# Altium project Signal Generator.PrjPcb (part 1 of 2)
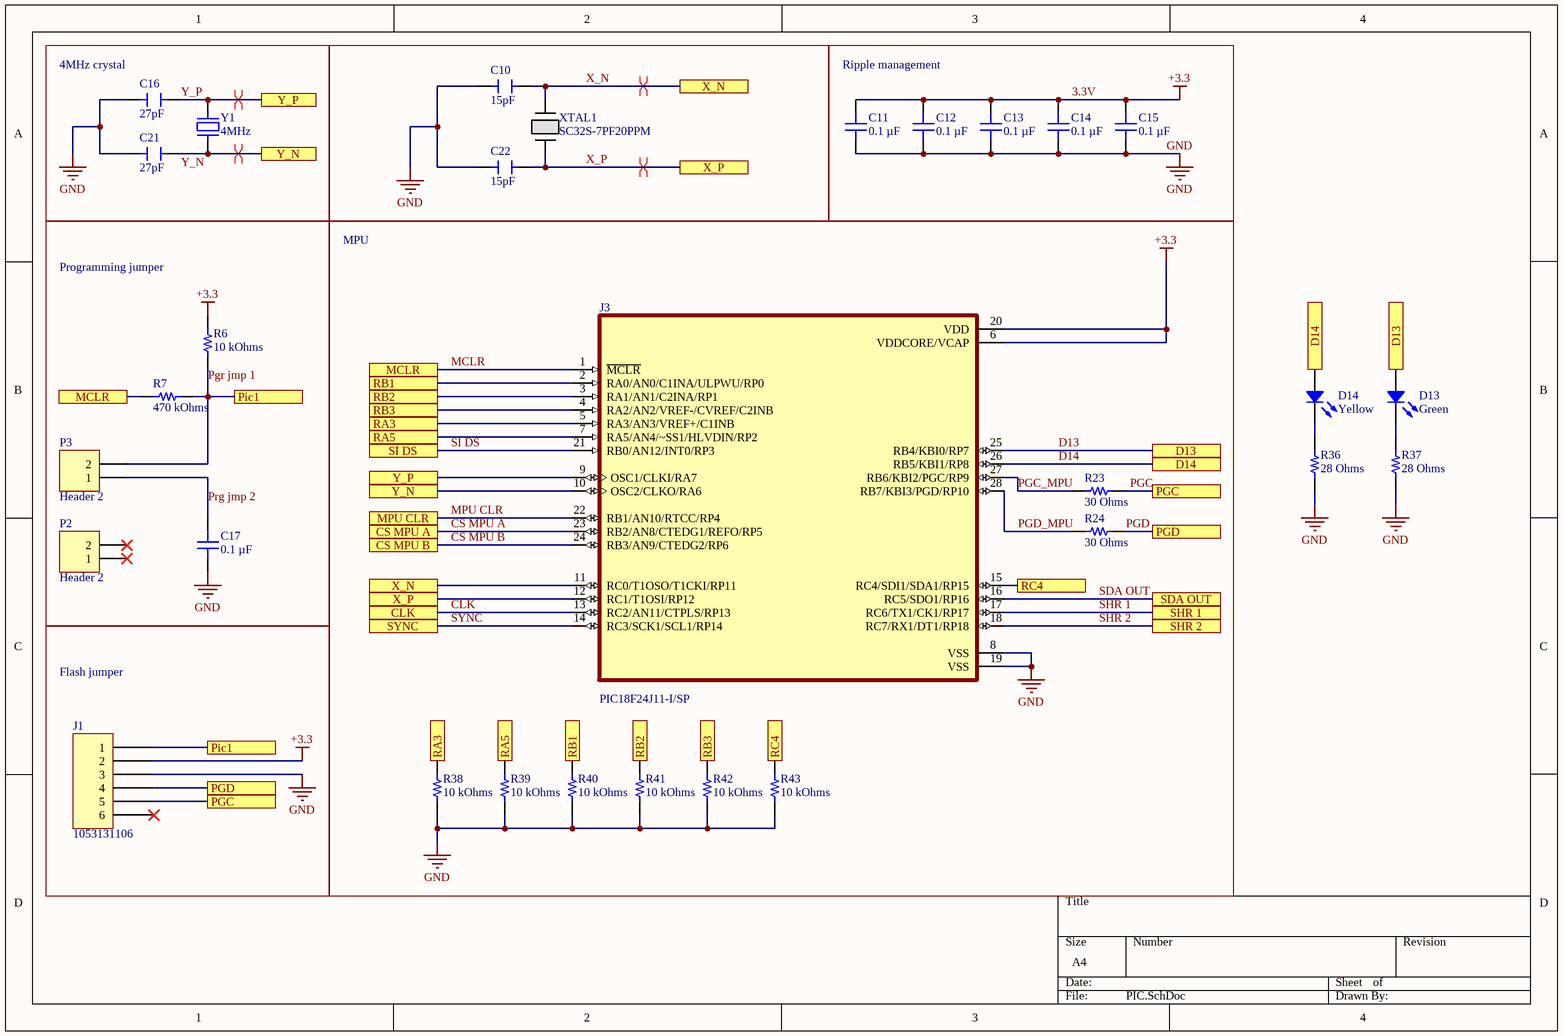
[diagram p0: PIC.SchDoc]
5 sheets, 137 parts. Net scope: flat (ports and power ports of the same name join across sheets).
Board file: PCB1.PcbDoc
Sheets:
  PIC.SchDoc
  Power management.SchDoc
  Oscillator.SchDoc
  Interface.SchDoc
  Shift register map.SchDoc

## Sheet PIC.SchDoc
size A4; SheetNumber: 1; SheetTotal: 5

### Parts
C10  15pF  [CAP MICA 27PF]
C11  0.1 µF  [CAP 0805_2012]
C12  0.1 µF  [CAP 0805_2012]
C13  0.1 µF  [CAP 0805_2012]
C14  0.1 µF  [CAP 0805_2012]
C15  0.1 µF  [CAP 0805_2012]
C16  27pF  [CAP MICA 27PF]
C17  0.1 µF  [CAP 0805_2012]
C21  27pF  [CAP MICA 27PF]
C22  15pF  [CAP MICA 27PF]
D13  Green  [LED 1206_3216 GREEN]
D14  Yellow  [LED 0805_2012 YELLOW]
J1  1053131106  [MOLEX 1053131106]
J3  PIC18F24J11-I/SP  [DIP787W45P254L3556H508Q28]
P2  Header 2  [HDR1X2]
P3  Header 2  [HDR1X2]
R6  10 kOhms  [RES 1210_3225]
R7  470 kOhms  [RES 1210_3225]
R23  30 Ohms  [RES 1210_3225]
R24  30 Ohms  [RES 1210_3225]
R36  28 Ohms  [RES 2512_6432]
R37  28 Ohms  [RES 2512_6432]
R38  10 kOhms  [RES 1210_3225]
R39  10 kOhms  [RES 1210_3225]
R40  10 kOhms  [RES 1210_3225]
R41  10 kOhms  [RES 1210_3225]
R42  10 kOhms  [RES 1210_3225]
R43  10 kOhms  [RES 1210_3225]
XTAL1  SC32S-7PF20PPM  [XTAL_SC32S-7PF20PPM_EPS]
Y1  4MHz  [ABRACON ABLS]

### Blocks framed on the sheet
4MHz crystal: C16 C21 Y1
Ripple management: C11-C15
Programming jumper: C17 P2 P3 R6 R7
MPU: J3 R23 R24 R38-R43
Flash jumper: J1

### Ports
CLK, CS MPU A, CS MPU B, D13, D14, MCLR, MPU CLR, PGC, PGD, Pic1, RA3, RA5, RB1, RB2, RB3, RC4, SDA OUT, SHR 1, SHR 2, SI DS, SYNC, X_N, X_P, Y_N, Y_P

### Nets
3.3V: C11.1 C12.2 C13.2 C14.2 C15.2 J1.2 J3.6(VDDCORE/VCAP) J3.20(VDD) R6.2  [also labelled +3.3]
GND: C10.1 C11.2 C12.1 C13.1 C14.1 C15.1 C16.1 C17.1 C21.1 C22.1 J1.3 J3.8(VSS) J3.19(VSS) R36.1 R37.1 R38.2 R39.1 R40.1 R41.1 R42.1 R43.1
CLK: J3.13(RC2/AN11/CTPLS/RP13) ; port CLK
CS MPU A: J3.23(RB2/AN8/CTEDG1/REFO/RP5) ; port CS MPU A
CS MPU B: J3.24(RB3/AN9/CTEDG2/RP6) ; port CS MPU B
D13: D13.1 J3.25(RB4/KBI0/RP7) ; port D13
D14: D14.1 J3.26(RB5/KBI1/RP8) ; port D14
MCLR: J3.1(~{MCLR}) R7.1 ; port MCLR
MPU CLR: J3.22(RB1/AN10/RTCC/RP4) ; port MPU CLR
PGC: J1.5 R23.2 ; port PGC
PGC_MPU: J3.27(RB6/KBI2/PGC/RP9) R23.1
PGD: J1.4 R24.2 ; port PGD
PGD_MPU: J3.28(RB7/KBI3/PGD/RP10) R24.1
Pgr jmp 1: J1.1 P3.2 R6.1 R7.2 ; port Pic1
Prg jmp 2: C17.2 P3.1
SDA OUT: J3.16(RC5/SDO1/RP16) ; port SDA OUT
SHR 1: J3.17(RC6/TX1/CK1/RP17) ; port SHR 1
SHR 2: J3.18(RC7/RX1/DT1/RP18) ; port SHR 2
SI DS: J3.21(RB0/AN12/INT0/RP3) ; port SI DS
SYNC: J3.14(RC3/SCK1/SCL1/RP14) ; port SYNC
X_N: C10.2 J3.11(RC0/T1OSO/T1CKI/RP11) XTAL1.2 ; port X_N
X_P: C22.2 J3.12(RC1/T1OSI/RP12) XTAL1.1 ; port X_P
Y_N: C21.2 J3.10(OSC2/CLKO/RA6) Y1.1 ; port Y_N
Y_P: C16.2 J3.9(OSC1/CLKI/RA7) Y1.2 ; port Y_P
NetD13_2: D13.2 R37.2
NetD14_2: D14.2 R36.2
NetJ3_2: J3.2(RA0/AN0/C1INA/ULPWU/RP0) R40.2 ; port RB1
NetJ3_3: J3.3(RA1/AN1/C2INA/RP1) R41.2 ; port RB2
NetJ3_4: J3.4(RA2/AN2/VREF-/CVREF/C2INB) R42.2 ; port RB3
NetJ3_5: J3.5(RA3/AN3/VREF+/C1INB) R38.1 ; port RA3
NetJ3_7: J3.7(RA5/AN4/~SS1/HLVDIN/RP2) R39.2 ; port RA5
NetJ3_15: J3.15(RC4/SDI1/SDA1/RP15) R43.2 ; port RC4

Not connected (* = marked no-connect by the designer): J1 6*; P2 1* 2*

### Layout directives
differential pair; net class Y_P: Y_P
differential pair; net class Y_N: Y_N
differential pair; net class X_N: X_N
differential pair; net class X_P: X_P

### Library data of the parts
C10 C22 = CAP MICA 10PF: CAP MICA 15PF 5% 500V RADIAL; Supplier 1: Digikey; Value: 15pF; Supplier Part Number 1: 338-2618-ND
C11-C15 C17 = C0805X104K5RAC7210: .100UF 50.0V; manufacturer: KEMET; Temperature Coefficient: X7R; Tolerance: ±10%; Voltage - Rated: 50V; Part Number: C0805X104K5RAC7210; Value: 0.1 µF; Applications: Boardflex Sensitive; Capacitance: 0.1 µF; componentlink1description: Datasheet; componentlink1url: https://connect.kemet.com:7667/gateway/IntelliData-ComponentDocumentation/1.0/download/datasheet/C0805X104K5RAC7210; componentlink2description: DigiKey Link; componentlink2url: https://www.digikey.com/en/products/detail/kemet/C0805X104K5RAC7210/12082600; Device Package: 0805 (2012 Metric); Features: Soft Termination; lastupdated: 9/02/2024 8:14:45 PM; Lifecycle Status: Active; Minimum Order: 1; Mounting Type: Surface Mount, MLCC; Operating Temperature: -55°C ~ 125°C; Package / Case: 0805 (2012 Metric); packaging: TapeAndReel; partid: 48810; Part Status: Active; price: 0.05; series: SMD Comm X7R Flex; Size / Dimension: 0.079" L x 0.049" W (2.00mm x 1.25mm); Supplier 1: DigiKey; Supplier Part Number 1: 399-C0805X104K5RAC7210CT-ND; Thickness (Max): 0.039" (0.98mm)
C16 C21 = CAP MICA 27PF: CAP MICA 27PF 5% 500V RADIAL; Supplier 1: Digikey; Supplier Part Number 1: 338-2623-ND; Value: 27pF
D13 = XZVG60W: LED GREEN CLEAR 2SMD; Manufacturer: SunLED; Configuration: Standard; Current - Test: 20mA; Lens Color: Colorless; Lens Size: 2.00mm x 1.50mm; Lens Style: Rectangle with Flat Top; Millicandela Rating: 118mcd; Viewing Angle: 70°; Voltage - Forward (Vf) (Typ): 2.1V; Wavelength - Dominant: 570nm; Wavelength - Peak: 574nm; Part Number: XZVG60W; Color: Green; ComponentLink1Description: Datasheet; ComponentLink1URL: https://www.sunledusa.com/products/spec/XZVG60W.pdf; ComponentLink2Description: DigiKey Link; ComponentLink2URL: https://www.digikey.com/en/products/detail/sunled/XZVG60W/4902123; Device Package: 1206 (3216 Metric); Height (Max): 1.40mm; LastUpdated: 3/06/2024 7:59:11 PM; Lens Transparency: Clear; Lifecycle Status: Active; Minimum Order: 1; Mounting Type: Surface Mount; Package / Case: 1206 (3216 Metric); Packaging: TapeAndReel; PartId: 1002; Part Status: Active; Price: 0.07; Series: -; Size / Dimension: 3.00mm L x 1.50mm W; Supplier 1: DigiKey; Supplier Part Number 1: 1497-1398-1-ND; Supplier Device Package: 2-SMD; Value: Green
D14 = XZUY54W-1: LED YELLOW CLEAR CHIP SMD; Manufacturer: SunLED; Configuration: Standard; Current - Test: 20mA; Lens Color: Colorless; Lens Size: 1.20mm x 1.25mm; Lens Style: Rectangle with Flat Top; Millicandela Rating: 7mcd; Viewing Angle: 120°; Voltage - Forward (Vf) (Typ): 2.1V; Wavelength - Dominant: 588nm; Wavelength - Peak: 590nm; Part Number: XZUY54W-1; Color: Yellow; ComponentLink1Description: Datasheet; ComponentLink1URL: https://www.sunledusa.com/products/spec/XZUY54W-1.pdf; ComponentLink2Description: DigiKey Link; ComponentLink2URL: https://www.digikey.com/en/products/detail/sunled/XZUY54W-1/4745811; Device Package: 0805 (2012 Metric); Height (Max): 0.75mm; LastUpdated: 3/06/2024 8:01:27 PM; Lens Transparency: Clear; Lifecycle Status: Active; Minimum Order: 1; Mounting Type: Surface Mount; Package / Case: 0805 (2012 Metric); Packaging: TapeAndReel; PartId: 43; Part Status: Active; Price: 0.04; Series: -; Size / Dimension: 2.00mm L x 1.25mm W; Supplier 1: DigiKey; Supplier Part Number 1: 1497-1210-1-ND; Supplier Device Package: Chip LED; Value: Yellow
J1 = 1053131106: CONN HEADER R/A 6POS 2.5MM; Manufacturer: Molex; Contact Length - Post: 0.126" (3.20mm); Number of Positions: 6; Number of Positions Loaded: All; Pitch - Mating: 0.098" (2.50mm); Row Spacing - Mating: -40°C ~ 105°C; Shrouding: Shrouded - 4 Wall; Style: Board to Cable/Wire; Part Number: 1053131106; ComponentLink1Description: Datasheet; ComponentLink1URL: https://www.molex.com/pdm_docs/ps/PS-105300-100-001.pdf; ComponentLink2Description: DigiKey Link; ComponentLink2URL: https://www.digikey.com/en/products/detail/molex/1053131106/7693178; Connector Type: Header; Contact Finish - Mating: Tin; Contact Finish - Post: Tin; Contact Finish Thickness - Mating: 59.0µin (1.50µm); Contact Material: Brass; Contact Shape: Square; Contact Type: Male Pin; Fastening Type: Latch Holder; Features: Board Guide; Insulation Color: Black; Insulation Height: 0.149" (3.78mm); Insulation Material: Liquid Crystal Polymer (LCP); LastUpdated: 11/08/2022 9:49:49 AM; Lifecycle Status: Active; Minimum Order: 1; Mounting Type: Through Hole, Right Angle; Number of Rows: 1; Operating Temperature: -40°C ~ 105°C; Packaging: Tray; PartId: 145; Part Status: Active; Price: 0.75; Series: Nano-Fit 105313; Supplier 1: DigiKey; Supplier Part Number 1: WM16897-ND; Termination: Solder
J3 = PIC18F24J11-I/SP: 28-Pin, 16KB Flash, 4KB RAM, 12 MIPS, nanoWatt | Microchip Technology Inc. PIC18F24J11-I/SP; SnapEDA_Link: https://www.snapeda.com/parts/PIC18F24J11-I/SP/Microchip/view-part/?ref=snap; Package: SPDIP-28 Microchip; Value: *; MF: Microchip; MP: PIC18F24J11-I/SP; Check_prices: https://www.snapeda.com/parts/PIC18F24J11-I/SP/Microchip/view-part/?ref=eda
P2 P3 = Header 2: Header, 2-Pin; LatestRevisionDate: 17-Jul-2002; LatestRevisionNote: Re-released for DXP Platform.; Publisher: Altium Limited
R6 R38-R43 = CRMA1210AF10K0FKEF: CRMA1210 10K 1% EF E3; Manufacturer: Vishay Dale; Power (Watts): 0.35W; Temperature Coefficient: ±100ppm/°C; Part Number: CRMA1210AF10K0FKEF; ComponentLink1Description: Datasheet; ComponentLink1URL: https://www.vishay.com/docs/68043/crma.pdf; ComponentLink2Description: DigiKey Link; ComponentLink2URL: https://www.digikey.com/en/products/detail/vishay-dale/CRMA1210AF10K0FKEF/13998641; Composition: Thick Film; Device Package: 1210 (3225 Metric); Features: Automotive AEC-Q200, Moisture Resistant; Height - Seated (Max): 0.029" (0.74mm); LastUpdated: 3/06/2024 8:18:49 PM; Lifecycle Status: Active; Minimum Order: 1; Number of Terminations: 2; Operating Temperature: -55°C ~ 155°C; Package / Case: 1210 (3225 Metric); Packaging: TapeAndReel; Part Status: Active; Price: 0.17; Ratings: AEC-Q200; Resistance: 10 kOhms; Series: CRMA; Size / Dimension: 0.125" L x 0.100" W (3.18mm x 2.54mm); Supplier 1: DigiKey; Supplier Part Number 1: 541-CRMA1210AF10K0FKEFCT-ND; Supplier Device Package: 1210; Tolerance: ±1%; Value: 10 kOhms
R7 = CRCW1210470KJNEA: RES SMD 470K OHM 5% 1/2W 1210; Manufacturer: Vishay Dale; Power (Watts): 0.5W, 1/2W; Temperature Coefficient: ±200ppm/°C; Part Number: CRCW1210470KJNEA; ComponentLink1Description: Datasheet; ComponentLink1URL: http://www.vishay.com/docs/20035/dcrcwe3.pdf; ComponentLink2Description: DigiKey Link; ComponentLink2URL: https://www.digikey.com/en/products/detail/vishay-dale/CRCW1210470KJNEA/1177238; Composition: Thick Film; Device Package: 1210 (3225 Metric); Features: Automotive AEC-Q200; Height - Seated (Max): 0.024" (0.60mm); LastUpdated: 3/06/2024 8:19:03 PM; Lifecycle Status: Active; Minimum Order: 1; Number of Terminations: 2; Operating Temperature: -55°C ~ 155°C; Package / Case: 1210 (3225 Metric); Packaging: TapeAndReel; Part Status: Active; Price: 0.02; Ratings: AEC-Q200; Resistance: 470 kOhms; Series: D/CRCW e3; Size / Dimension: 0.126" L x 0.098" W (3.20mm x 2.50mm); Supplier 1: DigiKey; Supplier Part Number 1: 541-470KVCT-ND; Supplier Device Package: 1210; Tolerance: ±5%; Value: 470 kOhms
R23 R24 = MP30R00: MP30R00 0.1% BULK; Manufacturer: Vishay Foil Resistors (Division of Vishay Precision Group); Power (Watts): 0.1W, 1/10W; Temperature Coefficient: ±10ppm/°C; Part Number: MP30R00; ComponentLink1Description: Datasheet; ComponentLink1URL: https://media.digikey.com/pdf/Data%20Sheets/Vishay%20Resistors/MP,%20MQ_Series.pdf; ComponentLink2Description: DigiKey Link; ComponentLink2URL: https://www.digikey.com/en/products/detail/vishay-foil-resistors-division-of-vishay-precision-group/MP30R00/8580916; Composition: Metal Foil; Device Package: 1210 (3225 Metric); Height - Seated (Max): 0.087" (2.20mm); LastUpdated: 3/06/2024 8:18:48 PM; Lifecycle Status: Active; Minimum Order: 1; Number of Terminations: 2; Operating Temperature: -65°C ~ 175°C; Package / Case: 1210 (3225 Metric); Packaging: Bulk; Part Status: Active; Price: 4.65; Resistance: 30 Ohms; Series: MP; Size / Dimension: 0.126" L x 0.098" W (3.20mm x 2.50mm); Supplier 1: DigiKey; Supplier Part Number 1: MP30R00-ND; Supplier Device Package: 2-SMD; Tolerance: ±0.1%; Value: 30 Ohms
R36 R37 = RK73H3ATTE28R0F: RES 28 OHM 1% 1W 2512; manufacturer: KOA Speer Electronics, Inc.; Temperature Coefficient: ±100ppm/°C; Part Number: RK73H3ATTE28R0F; componentlink1description: Datasheet; componentlink1url: http://www.koaspeer.com/catimages/Products/RK73H/RK73H.pdf; componentlink2description: DigiKey Link; componentlink2url: http://digikey.com/product-detail/en/koa-speer-electronics-inc/RK73H3ATTE28R0F/2019-RK73H3ATTE28R0FCT-ND/10425047; Composition: Thick Film; Device Package: 2512 (6432 Metric); Features: Automotive AEC-Q200, Moisture Resistant; Height - Seated (Max): 0.028" (0.70mm); lastupdated: 11/04/2023 8:12:36 PM; Lifecycle Status: Active; Minimum Order: 1; Number of Terminations: 2; Operating Temperature: -55°C ~ 155°C; Package / Case: 2512 (6432 Metric); packaging: TapeAndReel; Part Status: Active; Power (Watts): 1W; price: 0.05; Ratings: AEC-Q200; Resistance: 28 Ohms; series: RK73H; Size / Dimension: 0.248" L x 0.122" W (6.30mm x 3.10mm); Supplier 1: DigiKey; Supplier Part Number 1: 2019-RK73H3ATTE28R0FCT-ND; Supplier Device Package: 2512; Tolerance: ±1%; value: 28 Ohms
XTAL1 = SC32S-7PF20PPM: No Description Available; Mfr_Name: Epson
Y1 = ABLS-4.000MHZ-20-D-4-H-T: CRYSTAL 4.0000MHZ 20PF SMD; Manufacturer: Abracon LLC; ESR (Equivalent Series Resistance): 180 Ohms; Frequency Stability: ±35ppm; Frequency Tolerance: ±30ppm; Operating Mode: Fundamental; Part Number: ABLS-4.000MHZ-20-D-4-H-T; ComponentLink1Description: Datasheet; ComponentLink1URL: https://abracon.com/Resonators/abls.pdf; ComponentLink2Description: DigiKey Link; ComponentLink2URL: http://digikey.com/product-detail/en/abracon-llc/ABLS-4.000MHZ-20-D-4-H-T/535-14920-1-ND/9997997; Frequency: 4MHz; Height - Seated (Max): 0.165" (4.20mm); LastUpdated: 8/02/2024 9:34:21 PM; Lifecycle Status: Active; Load Capacitance: 20pF; Minimum Order: 1; Mounting Type: Surface Mount; Operating Temperature: -40°C ~ 85°C; Package / Case: HC-49/US; Packaging: TapeAndReel; PartId: 85; Part Status: Active; Price: 0.29; Series: ABLS; Size / Dimension: 0.449" L x 0.185" W (11.40mm x 4.70mm); Supplier 1: DigiKey; Supplier Part Number 1: 535-14920-1-ND; Type: MHz Crystal; Value: 4MHz

## Sheet Power management.SchDoc
size A4; SheetNumber: 2; SheetTotal: 5
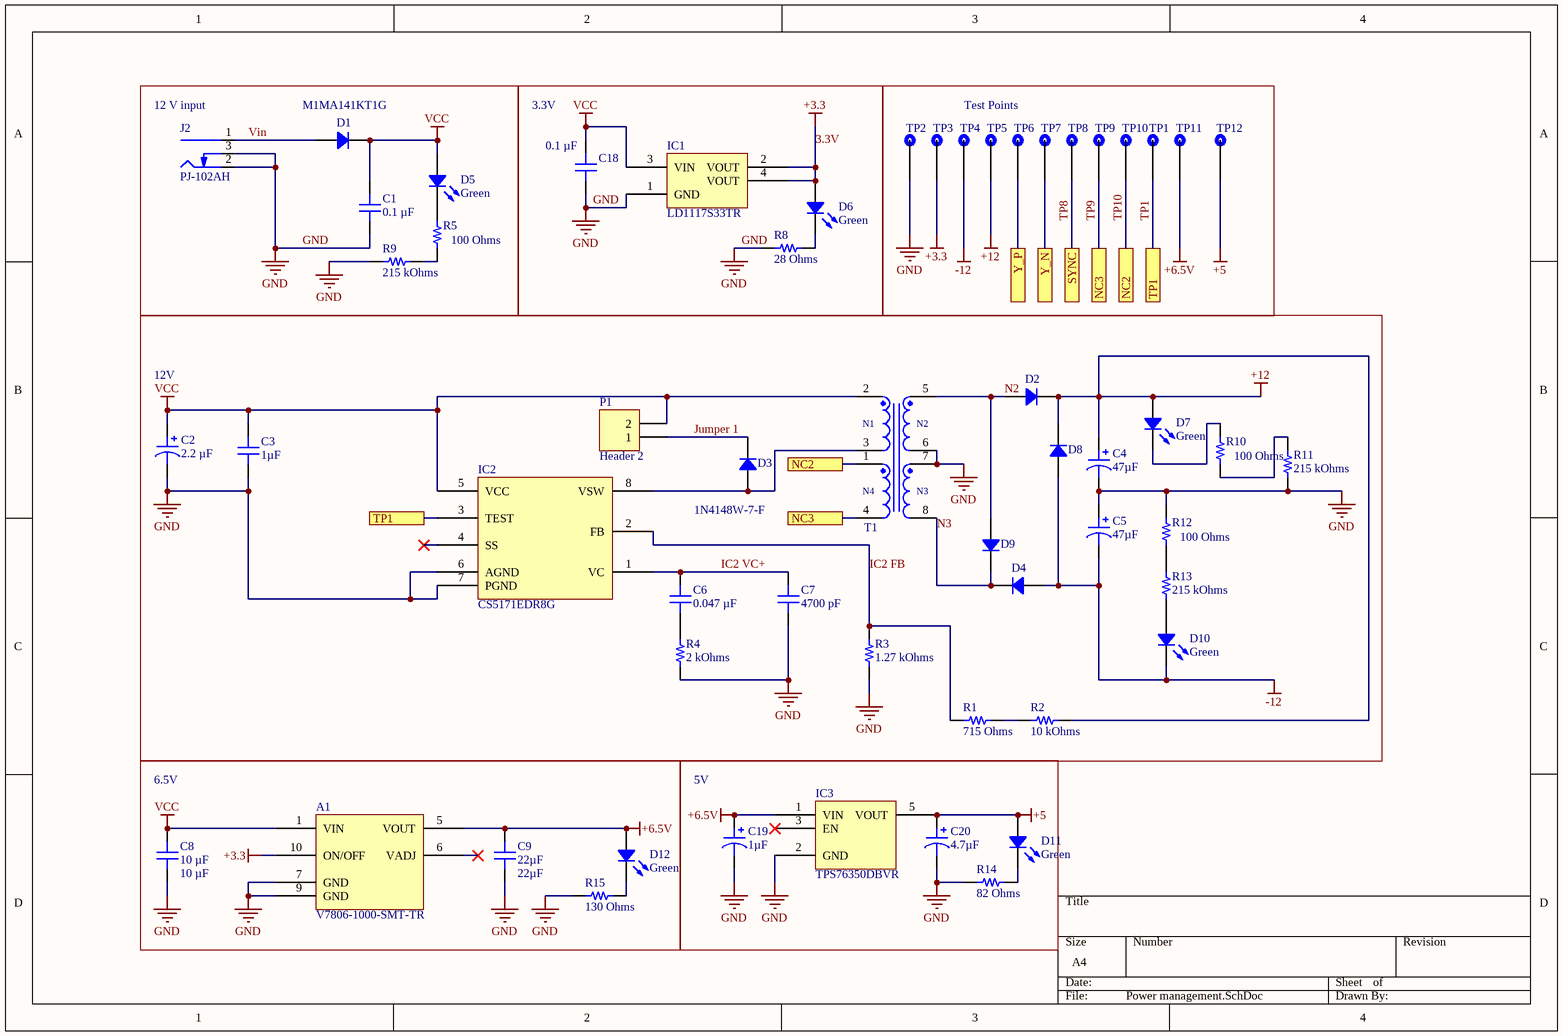
[diagram p1: Power management.SchDoc]

### Parts
A1  V7806-1000-SMT-TR  [CUI V78]
C1  0.1 µF  [CAP 0805_2012]
C2  2.2 µF  [CAP AL TH D8 L3.5 H12.5]
C3  1µF  [CAP 1206_3216 - 1.0MM]
C4  47µF  [CAP TH ALUM ELEC D6.30mm S2.50mm H12.70mm]
C5  47µF  [CAP TH ALUM ELEC D6.30mm S2.50mm H12.70mm]
C6  0.047 µF  [CAP 1206_3216 - 0.8MM]
C7  4700 pF  [CAP 1206_3216 - 0.8MM]
C8  10 µF  [CAP 1210_3225 - 1MM]
C9  22µF  [CAP 1210_3225 - 2.8MM]
C18  0.1 µF  [CAP 1210_3225 - 1MM]
C19  1µF  [CAP TH ALUM ELEC D4.00mm S1.50mm H6.00mm]
C20  4.7µF  [CAP TH ALUM ELEC D4.00mm S1.50mm H6.00mm]
D1  M1MA141KT1G  [DIODES SOT-323-3]
D2  MBRS140T3G  [DO214AA SMB]  (value not drawn)
D3  1N4148W-7-F  [SOD-123]
D4  MBRS140T3G  [DO214AA SMB]  (value not drawn)
D5  Green  [LED 1206_3216 GREEN]
D6  Green  [LED 1206_3216 GREEN]
D7  Green  [LED 1206_3216 GREEN]
D8  MBRS140T3G  [DO214AA SMB]  (value not drawn)
D9  MBRS140T3G  [DO214AA SMB]  (value not drawn)
D10  Green  [LED 1206_3216 GREEN]
D11  Green  [LED 1206_3216 GREEN]
D12  Green  [LED 1206_3216 GREEN]
IC1  LD1117S33TR  [ST SOT-223]
IC2  CS5171EDR8G  [ON SEMI SO-8]
IC3  TPS76350DBVR  [TI SOT-23-5 DBV]
J2  PJ-102AH  [CUI PJ-102AH]
P1  Header 2  [HDR1X2]
R1  715 Ohms  [RES 1210_3225]
R2  10 kOhms  [RES 1210_3225]
R3  1.27 kOhms  [RES 1210_3225]
R4  2 kOhms  [RES 1210_3225]
R5  100 Ohms  [RES 2512_6432]
R8  28 Ohms  [RES 2512_6432]
R9  215 kOhms  [RES 2512_6432]
R10  100 Ohms  [RES 2512_6432]
R11  215 kOhms  [RES 2512_6432]
R12  100 Ohms  [RES 2512_6432]
R13  215 kOhms  [RES 2512_6432]
R14  82 Ohms  [RES 2512_6432]
R15  130 Ohms  [RES 2512_6432]
T1  Ui = 30-57V, Uo1 = 12V/5A, Uo2 = -12V/1.6A  [WE-PoE++_EFD20_THT_L21.08W21.08H10.8]  (value not drawn)
TP1  TP_1  [Test_point_1]  (value not drawn)  (no BOM)
TP2  TP_1  [Test_point_1]  (value not drawn)  (no BOM)
TP3  TP_1  [Test_point_1]  (value not drawn)  (no BOM)
TP4  TP_1  [Test_point_1]  (value not drawn)  (no BOM)
TP5  TP_1  [Test_point_1]  (value not drawn)  (no BOM)
TP6  TP_1  [Test_point_1]  (value not drawn)  (no BOM)
TP7  TP_1  [Test_point_1]  (value not drawn)  (no BOM)
TP8  TP_1  [Test_point_1]  (value not drawn)  (no BOM)
TP9  TP_1  [Test_point_1]  (value not drawn)  (no BOM)
TP10  TP_1  [Test_point_1]  (value not drawn)  (no BOM)
TP11  TP_1  [Test_point_1]  (value not drawn)  (no BOM)
TP12  TP_1  [Test_point_1]  (value not drawn)  (no BOM)

### Blocks framed on the sheet
12 V input: C1 D1 D5 J2 R5 R9
3.3V: C18 D6 IC1 R8
Test Points: TP1-TP12
12V: C2-C7 D2-D4 D7-D10 IC2 P1 R1-R4 R10-R13 T1
6.5V: A1 C8 C9 D12 R15
5V: C19 C20 D11 IC3 R14

### Ports
NC2, NC3, SYNC, TP1, Y_N, Y_P

### Nets
3.3V: A1.10(ON/OFF) D6.1 IC1.2(VOUT) IC1.4(VOUT) TP3.TP1(P1)  [also labelled +3.3]
+5: C20.1 D11.1 IC3.5(VOUT) TP12.TP1(P1)
+6.5V: A1.5(VOUT) C9.2 C19.1 D12.1 IC3.1(VIN) TP11.TP1(P1)
+12: C4.1 D2.2 D7.1 D8.2 R2.2 TP5.TP1(P1)
-12: C5.2 D4.1 D8.1 D10.2 TP4.TP1(P1)
GND: A1.7(GND) A1.9(GND) C1.1 C2.2 C3.1 C4.2 C5.1 C7.1 C8.1 C9.1 C18.1 C19.2 C20.2 IC1.1(GND) IC2.6(AGND) IC2.7(PGND) IC3.2(GND) J2.2(Outer) J2.3(SW) R3.1 R4.1 R8.1 R9.1 R11.1 R12.2 R14.1 R15.1 T1.6 T1.7 TP2.TP1(P1)
VCC: A1.1(VIN) C1.2 C2.1 C3.2 C8.2 C18.2 D1.2 D5.1 IC1.3(VIN) IC2.5(VCC) P1.2 T1.2
IC2 FB: IC2.2(FB) R1.1 R3.2
IC2 VC+: C6.2 C7.2 IC2.1(VC)
Jumper 1: D3.2 P1.1
N2: D2.1 D9.1 T1.5
N3: D4.2 D9.2 T1.8
TP1: IC2.3(TEST) TP1.TP1(P1) ; port TP1
TP8: TP8.TP1(P1) ; port SYNC  [project net SYNC]
TP9: T1.4 TP9.TP1(P1) ; port NC3
TP10: T1.1 TP10.TP1(P1) ; port NC2
Vin: D1.1 J2.1(Centre)
Y_N: TP7.TP1(P1) ; port Y_N
Y_P: TP6.TP1(P1) ; port Y_P
NetC6_1: C6.1 R4.2
NetD3_1: D3.1 IC2.8(VSW) T1.3
NetD5_2: D5.2 R5.2
NetD6_2: D6.2 R8.2
NetD7_2: D7.2 R10.2
NetD10_1: D10.1 R13.1
NetD11_2: D11.2 R14.2
NetD12_2: D12.2 R15.2
NetR1_2: R1.2 R2.1
NetR5_1: R5.1 R9.2
NetR10_1: R10.1 R11.2
NetR12_1: R12.1 R13.2

Not connected (* = marked no-connect by the designer): A1 6(VADJ)*; IC2 4(SS)*; IC3 3(EN)*

### Notes on the sheet
- (in symbol 750310042) N1; N2; N4; N3

### Library data of the parts
A1 = V7806-1000-SMT-TR: DC DC CONVERTER 6.5V 7W; Part Number: V7806-1000-SMT-TR
C1 = C0805X104K5RAC7210: as C11 on sheet PIC; Part Number: C0805X104K5RAC7210; Value: 0.1 µF; Applications: Boardflex Sensitive; Capacitance: 0.1 µF; componentlink1description: Datasheet; componentlink1url: https://connect.kemet.com:7667/gateway/IntelliData-ComponentDocumentation/1.0/download/datasheet/C0805X104K5RAC7210; componentlink2description: DigiKey Link; componentlink2url: https://www.digikey.com/en/products/detail/kemet/C0805X104K5RAC7210/12082600; Device Package: 0805 (2012 Metric); Features: Soft Termination; lastupdated: 9/02/2024 8:14:45 PM; Lifecycle Status: Active; Minimum Order: 1; Mounting Type: Surface Mount, MLCC; Operating Temperature: -55°C ~ 125°C; Package / Case: 0805 (2012 Metric); packaging: TapeAndReel; partid: 48810; Part Status: Active; price: 0.05; series: SMD Comm X7R Flex; Size / Dimension: 0.079" L x 0.049" W (2.00mm x 1.25mm); Supplier 1: DigiKey; Supplier Part Number 1: 399-C0805X104K5RAC7210CT-ND; Thickness (Max): 0.039" (0.98mm)
C2 = UVY2G2R2MPD: CAP ALUM 2.2UF 20% 400V RADIAL; manufacturer: Nichicon; Lifetime @ Temp.: 1000 Hrs @ 105°C; Polarization: Polar; Ripple Current @ High Frequency: 31.05 mA @ 10 kHz; Ripple Current @ Low Frequency: 27 mA @ 120 Hz; Part Number: UVY2G2R2MPD; Applications: General Purpose; Capacitance: 2.2 µF; componentlink1description: Datasheet; componentlink1url: http://nichicon-us.com/english/products/pdfs/e-uvy.pdf; componentlink2description: DigiKey Link; componentlink2url: https://www.digikey.com/en/products/detail/nichicon/UVY2G2R2MPD/2539761; Device Package: Radial, Can; Height - Seated (Max): 0.492" (12.50mm); lastupdated: 8/02/2024 9:38:05 PM; Lead Spacing: 0.138" (3.50mm); Lifecycle Status: Active; Minimum Order: 1; Mounting Type: Through Hole; Operating Temperature: -40°C ~ 105°C; Package / Case: Radial, Can; packaging: Bulk; partid: 7299; Part Status: Active; price: 0.15; series: UVY; Size / Dimension: 0.315" Dia (8.00mm); Supplier 1: DigiKey; Supplier Part Number 1: 493-16197-ND; Tolerance: ±20%; value: 2.2 µF; Voltage - Rated: 400 V
C3 = 12065C105K4Z2A: CAP CER 1UF 50V X7R 1206; manufacturer: AVX Corporation; Tolerance: ±10%; Part Number: 12065C105K4Z2A; Value: 1µF; Applications: Automotive, Boardflex Sensitive; Capacitance: 1µF; componentlink1description: Datasheet; componentlink1url: http://datasheets.avx.com/AutoMLCC.pdf; componentlink2description: DigiKey Link; componentlink2url: http://digikey.com/product-detail/en/avx-corporation/12065C105K4Z2A/478-10886-1-ND/7536455; Device Package: 1206 (3216 Metric); Features: Soft Termination; lastupdated: 2/09/2020 1:05:06 AM; Lifecycle Status: Active; Minimum Order: 1; Mounting Type: Surface Mount, MLCC; Operating Temperature: -55°C ~ 125°C; Package / Case: 1206 (3216 Metric); packaging: TapeAndReel; partid: 18944; Part Status: Active; price: 0.12; Ratings: AEC-Q200; series: FLEXITERM®; Size / Dimension: 0.126" L x 0.063" W (3.20mm x 1.60mm); Supplier 1: DigiKey; Supplier Part Number 1: 478-10886-1-ND; Temperature Coefficient: X7R; Thickness (Max): 0.037" (0.94mm); Voltage - Rated: 50V
C4 C5 = EEU-FR1H470: AL LYTIC, RADIAL, 50VDC, 47UF; manufacturer: Panasonic Electronic Components; Impedance: 140 mOhms; Lifetime @ Temp.: 5000 Hrs @ 105°C; Polarization: Polar; Ripple Current @ High Frequency: 405mA @ 100kHz; Ripple Current @ Low Frequency: 283.5mA @ 120Hz; Tolerance: ±20%; Voltage - Rated: 50V; Part Number: EEU-FR1H470; Applications: General Purpose; Capacitance: 47µF; componentlink1description: Datasheet; componentlink1url: https://industrial.panasonic.com/cdbs/www-data/pdf/RDF0000/ABA0000C1022.pdf; componentlink2description: DigiKey Link; componentlink2url: http://digikey.com/product-detail/en/panasonic-electronic-components/EEU-FR1H470/P124235-ND/9921029; Device Package: Radial, Can; Height - Seated (Max): 0.500" (12.70mm); lastupdated: 4/09/2020 1:05:46 AM; Lead Spacing: 0.098" (2.50mm); Lifecycle Status: Active; Minimum Order: 1; Mounting Type: Through Hole; Operating Temperature: -40°C ~ 105°C; Package / Case: Radial, Can; packaging: Bulk; partid: 20220; Part Status: Active; price: 0.31; series: FR; Size / Dimension: 0.248" Dia (6.30mm); Supplier 1: DigiKey; Supplier Part Number 1: P124235-ND; value: 47µF
C6 = C1206C473K5RECAUTO: CAP CER 1206 47NF 50V X7R 10%; manufacturer: KEMET; Part Number: C1206C473K5RECAUTO; Value: 0.047 µF; Applications: Automotive, ESD Protection; Capacitance: 0.047 µF; componentlink1description: Datasheet; componentlink1url: https://api.kemet.com/component-edge/download/datasheet/C1206C473K5RECAUTO.pdf; componentlink2description: DigiKey Link; componentlink2url: https://www.digikey.com/en/products/detail/kemet/C1206C473K5RECAUTO/8640487; Device Package: 1206 (3216 Metric); lastupdated: 9/02/2024 8:18:49 PM; Lifecycle Status: Active; Minimum Order: 1; Mounting Type: Surface Mount, MLCC; Operating Temperature: -55°C ~ 125°C; Package / Case: 1206 (3216 Metric); packaging: TapeAndReel; partid: 19026; Part Status: Active; price: 0.03; Ratings: AEC-Q200; series: ESD SMD Auto X7R; Size / Dimension: 0.126" L x 0.063" W (3.20mm x 1.60mm); Supplier 1: DigiKey; Supplier Part Number 1: 399-17893-1-ND; Temperature Coefficient: X7R; Thickness (Max): 0.043" (1.10mm); Tolerance: ±10%; Voltage - Rated: 50V
C7 = GMC31CG472G50NT: CAP1206 COG 4700PF 2% 50V; manufacturer: Cal-Chip Electronics, Inc.; Temperature Coefficient: C0G, NP0; Part Number: GMC31CG472G50NT; Value: 4700 pF; Applications: General Purpose; Capacitance: 4700 pF; componentlink1description: Datasheet; componentlink1url: https://88ce57.p3cdn1.secureserver.net/wp-content/uploads/2023/01/gmc_series-2.pdf; componentlink2description: DigiKey Link; componentlink2url: https://www.digikey.com/en/products/detail/cal-chip-electronics-inc/GMC31CG472G50NT/19910712; Device Package: 1206 (3216 Metric); lastupdated: 9/02/2024 8:17:50 PM; Lifecycle Status: Active; Minimum Order: 1; Mounting Type: Surface Mount, MLCC; Operating Temperature: -55°C ~ 125°C; Package / Case: 1206 (3216 Metric); packaging: TapeAndReel; partid: 56643; price: 0.05; series: GMC; Size / Dimension: 0.126" L x 0.063" W (3.20mm x 1.60mm); Supplier 1: DigiKey; Supplier Part Number 1: 4713-GMC31CG472G50NTCT-ND; Thickness (Max): 0.037" (0.95mm); Tolerance: ±2%; Voltage - Rated: 50V
C8 = GCJ32EC71H106KA01L: CAP CER 10UF 50V X7S 1210; Part Number: GCJ32EC71H106KA01L; Value: 10 µF
C9 = 12103D226KAT2A: CAP CER 22UF 25V X5R 1210; Part Number: 12103D226KAT2A; Value: 22µF
C18 = C1210J104K2RAC7800: .100UF  200V; manufacturer: KEMET; Temperature Coefficient: X7R; Tolerance: ±10%; Part Number: C1210J104K2RAC7800; Value: 0.1 µF; Applications: Boardflex Sensitive; Capacitance: 0.1 µF; componentlink1description: Datasheet; componentlink1url: https://connect.kemet.com:7667/gateway/IntelliData-ComponentDocumentation/1.0/download/datasheet/C1210J104K2RAC7800; componentlink2description: DigiKey Link; componentlink2url: https://www.digikey.com/en/products/detail/kemet/C1210J104K2RAC7800/12082491; Device Package: 1210 (3225 Metric); Features: Open Mode, Soft Termination; lastupdated: 4/06/2024 7:20:48 PM; Lifecycle Status: Active; Minimum Order: 1; Mounting Type: Surface Mount, MLCC; Operating Temperature: -55°C ~ 125°C; Package / Case: 1210 (3225 Metric); packaging: TapeAndReel; partid: 49670; Part Status: Active; price: 0.24; series: SMD Comm X7R FO; Size / Dimension: 0.130" L x 0.102" W (3.30mm x 2.60mm); Supplier 1: DigiKey; Supplier Part Number 1: 399-C1210J104K2RAC7800CT-ND; Thickness (Max): 0.057" (1.45mm); Voltage - Rated: 200V
C19 = UMF1V010MDD: CAP ALUM 1UF 20% 35V RADIAL; manufacturer: Nichicon; Impedance: 5 Ohms; Lifetime @ Temp.: 1000 Hrs @ 105°C; Polarization: Polar; Ripple Current @ High Frequency: 50mA @ 100kHz; Ripple Current @ Low Frequency: 25mA @ 120Hz; Part Number: UMF1V010MDD; Applications: General Purpose; Capacitance: 1µF; componentlink1description: Datasheet; componentlink1url: http://nichicon-us.com/english/products/pdfs/e-umf.pdf; componentlink2description: DigiKey Link; componentlink2url: http://digikey.com/product-detail/en/nichicon/UMF1V010MDD/493-15541-ND/2598666; Device Package: Radial, Can; Height - Seated (Max): 0.236" (6.00mm); lastupdated: 6/09/2020 1:48:30 AM; Lead Spacing: 0.059" (1.50mm); Lifecycle Status: Active; Minimum Order: 1; Mounting Type: Through Hole; Operating Temperature: -55°C ~ 105°C; Package / Case: Radial, Can; packaging: Bulk; partid: 23219; Part Status: Active; price: 0.42; series: UMF; Size / Dimension: 0.157" Dia (4.00mm); Supplier 1: DigiKey; Supplier Part Number 1: 493-15541-ND; Tolerance: ±20%; value: 1µF; Voltage - Rated: 35V
C20 = UMF1V4R7MDD: CAP ALUM 4.7UF 20% 35V RADIAL; manufacturer: Nichicon; Impedance: 5 Ohms; Lifetime @ Temp.: 1000 Hrs @ 105°C; Polarization: Polar; Ripple Current @ High Frequency: 50mA @ 100kHz; Ripple Current @ Low Frequency: 25mA @ 120Hz; Part Number: UMF1V4R7MDD; Applications: General Purpose; Capacitance: 4.7µF; componentlink1description: Datasheet; componentlink1url: http://nichicon-us.com/english/products/pdfs/e-umf.pdf; componentlink2description: DigiKey Link; componentlink2url: http://digikey.com/product-detail/en/nichicon/UMF1V4R7MDD/493-15545-ND/2598673; Device Package: Radial, Can; Height - Seated (Max): 0.236" (6.00mm); lastupdated: 6/09/2020 1:48:30 AM; Lead Spacing: 0.059" (1.50mm); Lifecycle Status: Active; Minimum Order: 1; Mounting Type: Through Hole; Operating Temperature: -55°C ~ 105°C; Package / Case: Radial, Can; packaging: Bulk; partid: 23153; Part Status: Active; price: 0.42; series: UMF; Size / Dimension: 0.157" Dia (4.00mm); Supplier 1: DigiKey; Supplier Part Number 1: 493-15545-ND; Tolerance: ±20%; value: 4.7µF; Voltage - Rated: 35V
D1 = M1MA141KT1G: DIODE GEN PURP 40V 100MA SC70-3; Manufacturer: ON Semiconductor; Current - Average Rectified (Io): 100mA (DC); Current - Reverse Leakage @ Vr: 100nA @ 35V; Diode Type: Standard; Reverse Recovery Time (trr): 3ns; Speed: Small Signal =< 200mA (Io), Any Speed; Voltage - Forward (Vf) (Max) @ If: 1.2V @ 100mA; Part Number: M1MA141KT1G; ComponentLink1Description: Datasheet; ComponentLink1URL: http://www.onsemi.com/pub/Collateral/M1MA141KT1-D.PDF; ComponentLink2Description: DigiKey Link; ComponentLink2URL: http://digikey.com/product-detail/en/on-semiconductor/M1MA141KT1G/M1MA141KT1GOSCT-ND/917953; LastUpdated: 8/02/2024 9:34:01 PM; Lifecycle Status: Active; Minimum Order: 1; Mounting Type: Surface Mount; Operating Temperature - Junction: 150°C (Max); Package / Case: SC-70, SOT-323; Packaging: TapeAndReel; PartId: 8; Part Status: Active; Price: 0.03; Series: -; Supplier 1: DigiKey; Supplier Part Number 1: M1MA141KT1GOSCT-ND; Supplier Device Package: SC-70-3 (SOT323); Voltage - DC Reverse (Vr) (Max): 40V
D2 D4 D8 D9 = MBRS140T3G: DIODE SCHOTTKY 40V 1A SMB; Manufacturer: ON Semiconductor; Current - Reverse Leakage @ Vr: 1mA @ 40V; Speed: Fast Recovery =< 500ns, > 200mA (Io); Voltage - Forward (Vf) (Max) @ If: 600mV @ 1A; Part Number: MBRS140T3G; ComponentLink1Description: Datasheet; ComponentLink1URL: https://www.onsemi.com/pub/Collateral/MBRS140T3-D.PDF; ComponentLink2Description: DigiKey Link; ComponentLink2URL: http://digikey.com/product-detail/en/on-semiconductor/MBRS140T3G/MBRS140T3GOSCT-ND/918002; Current - Average Rectified (Io): 1A; Diode Type: Schottky; LastUpdated: 8/02/2024 9:26:46 PM; Lifecycle Status: Active; Minimum Order: 1; Mounting Type: Surface Mount; Operating Temperature - Junction: -65°C ~ 125°C; Package / Case: DO-214AA, SMB; Packaging: TapeAndReel; PartId: 1387; Part Status: Active; Price: 0.08; Series: -; Supplier 1: DigiKey; Supplier Part Number 1: MBRS140T3GOSCT-ND; Supplier Device Package: SMB; Voltage - DC Reverse (Vr) (Max): 40V
D3 = 1N4148W-7-F: DIODE GEN PURP 100V 300MA SOD123; Manufacturer: Diodes Incorporated; Capacitance @ Vr, F: 2pF @ 0V, 1MHz; Current - Reverse Leakage @ Vr: 1 µA @ 100 V; Diode Type: Standard; Reverse Recovery Time (trr): 4 ns; Speed: Fast Recovery =< 500ns, > 200mA (Io); Voltage - Forward (Vf) (Max) @ If: 1.25 V @ 150 mA; Part Number: 1N4148W-7-F; ComponentLink1Description: Datasheet; ComponentLink1URL: https://www.diodes.com/assets/Datasheets/ds30086.pdf; ComponentLink2Description: DigiKey Link; ComponentLink2URL: https://www.digikey.com/en/products/detail/diodes-incorporated/1N4148W-7-F/814371; Current - Average Rectified (Io): 300mA; LastUpdated: 8/02/2024 9:27:29 PM; Lifecycle Status: Active; Minimum Order: 1; Mounting Type: Surface Mount; Operating Temperature - Junction: -55°C ~ 150°C; Package / Case: SOD-123; Packaging: TapeAndReel; PartId: 1002; Part Status: Active; Price: 0.02; Series: -; Supplier 1: DigiKey; Supplier Part Number 1: 1N4148W-FDICT-ND; Supplier Device Package: SOD-123; Voltage - DC Reverse (Vr) (Max): 100 V
D5-D7 D10-D12 = XZVG60W: as D13 on sheet PIC; Part Number: XZVG60W; Color: Green; ComponentLink1Description: Datasheet; ComponentLink1URL: https://www.sunledusa.com/products/spec/XZVG60W.pdf; ComponentLink2Description: DigiKey Link; ComponentLink2URL: https://www.digikey.com/en/products/detail/sunled/XZVG60W/4902123; Device Package: 1206 (3216 Metric); Height (Max): 1.40mm; LastUpdated: 3/06/2024 7:59:11 PM; Lens Transparency: Clear; Lifecycle Status: Active; Minimum Order: 1; Mounting Type: Surface Mount; Package / Case: 1206 (3216 Metric); Packaging: TapeAndReel; PartId: 1002; Part Status: Active; Price: 0.07; Series: -; Size / Dimension: 3.00mm L x 1.50mm W; Supplier 1: DigiKey; Supplier Part Number 1: 1497-1398-1-ND; Supplier Device Package: 2-SMD; Value: Green
IC1 = LD1117S33TR: IC REG LINEAR 3.3V 800MA SOT223; Manufacturer: STMicroelectronics; Current - Quiescent (Iq): 10 mA; Number of Regulators: 1; Output Configuration: Positive; Output Type: Fixed; Protection Features: Over Current, Over Temperature; PSRR: 75dB (120Hz); Voltage Dropout (Max): 1.2V @ 800mA; Voltage - Input (Max): 15V; Part Number: LD1117S33TR; ComponentLink1Description: Datasheet; ComponentLink1URL: http://www.st.com/content/ccc/resource/technical/document/datasheet/99/3b/7d/91/91/51/4b/be/CD00000544.pdf/files/CD00000544.pdf/jcr:content/translations/en.CD00000544.pdf; ComponentLink2Description: DigiKey Link; ComponentLink2URL: https://www.digikey.com/en/products/detail/stmicroelectronics/LD1117S33TR/585766; Current - Output: 800mA; LastUpdated: 3/06/2024 8:14:20 PM; Lifecycle Status: Active; Minimum Order: 1; Mounting Type: Surface Mount; Operating Temperature: 0°C ~ 125°C; Package / Case: TO-261-4, TO-261AA; Packaging: TapeAndReel; Part Status: Active; Price: 0.13; Series: -; Supplier 1: DigiKey; Supplier Part Number 1: 497-1242-1-ND; Supplier Device Package: SOT-223; Voltage - Output (Min/Fixed): 3.3V
IC2 = CS5171EDR8G: IC REG MULT CONFG ADJ 1.5A 8SOIC; Manufacturer: ON Semiconductor; Current - Output: 1.5A (Switch); Frequency - Switching: 280kHz; Function: Step-Up, Step-Down, Step-Up/Step-Down; Number of Outputs: 1; Output Configuration: Positive or Negative; Output Type: Adjustable; Synchronous Rectifier: No; Topology: Buck, Boost, Flyback, Forward Converter, SEPIC; Voltage - Input (Max): 30V; Voltage - Input (Min): 2.7V; Voltage - Output (Max): 40V (Switch); Voltage - Output (Min/Fixed): 1.28V; Part Number: CS5171EDR8G; ComponentLink1Description: Datasheet; ComponentLink1URL: http://www.onsemi.com/pub/Collateral/CS5171-D.PDF; ComponentLink2Description: DigiKey Link; ComponentLink2URL: //digikey.com/product-detail/en/on-semiconductor/CS5171EDR8G/CS5171EDR8GOSTR-ND/918422; Device Package: 8-SOIC (0.154", 3.90mm Width); LastUpdated: 12/12/2019 8:27:18 AM; Lifecycle Status: 0; Minimum Order: 1; Mounting Type: Surface Mount; Operating Temperature: -40°C ~ 125°C (TJ); Package / Case: 8-SOIC (0.154", 3.90mm Width); Packaging: TapeAndReel; Part Status: Active; Price: 0.97; Series: -; Supplier 1: DigiKey; Supplier Part Number 1: CS5171EDR8GOSTR-ND; Supplier Device Package: 8-SOIC
IC3 = TPS76350DBVR: IC REG LINEAR 5V 150MA SOT23-5; Manufacturer: Texas Instruments; Control Features: Enable; Current - Quiescent (Iq): 100 µA; Current - Supply (Max): 140 µA; Number of Regulators: 1; Output Configuration: Positive; Output Type: Fixed; Protection Features: Over Current, Over Temperature, Reverse Polarity; PSRR: 60dB (1kHz); Voltage Dropout (Max): 0.3V @ 150mA; Voltage - Input (Max): 10V; Part Number: TPS76350DBVR; ComponentLink1Description: Datasheet; ComponentLink1URL: http://www.ti.com/general/docs/suppproductinfo.tsp?distId=10&gotoUrl=http%3A%2F%2Fwww.ti.com%2Flit%2Fgpn%2Ftps763; ComponentLink2Description: DigiKey Link; ComponentLink2URL: https://www.digikey.com/en/products/detail/texas-instruments/TPS76350DBVR/382163; Current - Output: 150mA; LastUpdated: 3/06/2024 8:14:19 PM; Lifecycle Status: Active; Minimum Order: 1; Mounting Type: Surface Mount; Operating Temperature: -40°C ~ 125°C; Package / Case: SC-74A, SOT-753; Packaging: TapeAndReel; Part Status: Active; Price: 0.22; Series: -; Supplier 1: DigiKey; Supplier Part Number 1: 296-11023-1-ND; Supplier Device Package: SOT-23-5; Voltage - Output (Min/Fixed): 5V
J2 = PJ-102AH: CONN PWR JACK 2X5.5MM SOLDER; Manufacturer: CUI Devices; Actual Diameter: 0.079" (2.00mm ID), 0.256" (6.50mm OD); Current Rating (Amps): 5A; Gender: Male; Industry Recognized Mating Diameter: 2.00mm ID (0.079"), 5.50mm OD (0.217"); Internal Switch(s): Single Switch, Normally Closed; Material Flammability Rating: UL94 V-0; Mating Length/Depth: 0.354" (9.00mm); Number of Positions/Contacts: 2 Conductors, 3 Contacts; Shielding: Unshielded; Voltage - Rated: 24VDC; Part Number: PJ-102AH; ComponentLink1Description: Datasheet; ComponentLink1URL: https://www.cuidevices.com/product/resource/digikeypdf/pj-102ah.pdf; ComponentLink2Description: DigiKey Link; ComponentLink2URL: //digikey.com/product-detail/en/cui-devices/PJ-102AH/CP-102AH-ND/408448; Connector Type: Jack; LastUpdated: 16/12/2019 7:01:27 PM; Lifecycle Status: 0; Minimum Order: 1; Mounting Type: Through Hole, Right Angle; Packaging: Tray; Part Status: Active; Price: 0.76; Series: -; Supplier 1: DigiKey; Supplier Part Number 1: CP-102AH-ND; Termination: Solder
P1 = Header 2: Header, 2-Pin; LatestRevisionDate: 17-Jul-2002; LatestRevisionNote: Re-released for DXP Platform.; Publisher: Altium Limited
R1 = CRCW1210715RFKEA: RES SMD 715 OHM 1% 1/2W 1210; Manufacturer: Vishay Dale; Power (Watts): 0.5W, 1/2W; Temperature Coefficient: ±100ppm/°C; Part Number: CRCW1210715RFKEA; ComponentLink1Description: Datasheet; ComponentLink1URL: http://www.vishay.com/docs/20035/dcrcwe3.pdf; ComponentLink2Description: DigiKey Link; ComponentLink2URL: https://www.digikey.com/en/products/detail/vishay-dale/CRCW1210715RFKEA/1177340; Composition: Thick Film; Device Package: 1210 (3225 Metric); Features: Automotive AEC-Q200; Height - Seated (Max): 0.024" (0.60mm); LastUpdated: 8/02/2024 9:49:36 PM; Lifecycle Status: Active; Minimum Order: 1; Number of Terminations: 2; Operating Temperature: -55°C ~ 155°C; Package / Case: 1210 (3225 Metric); Packaging: TapeAndReel; Part Status: Active; Price: 0.02; Ratings: AEC-Q200; Resistance: 715 Ohms; Series: CRCW; Size / Dimension: 0.126" L x 0.098" W (3.20mm x 2.50mm); Supplier 1: DigiKey; Supplier Part Number 1: 541-715AACT-ND; Supplier Device Package: 1210; Tolerance: ±1%; Value: 715 Ohms
R2 = ERJ-P14D1002U: RES SMD 10K OHM 0.5% 1/2W 1210; Manufacturer: Panasonic Electronic Components; Power (Watts): 0.5W, 1/2W; Temperature Coefficient: ±100ppm/°C; Part Number: ERJ-P14D1002U; ComponentLink1Description: Datasheet; ComponentLink1URL: https://industrial.panasonic.com/cdbs/www-data/pdf/RDO0000/AOA0000C331.pdf; ComponentLink2Description: DigiKey Link; ComponentLink2URL: https://www.digikey.com/en/products/detail/panasonic-electronic-components/ERJ-P14D1002U/3982725; Composition: Thick Film; Device Package: 1210 (3225 Metric); Features: Automotive AEC-Q200, Pulse Withstanding; Height - Seated (Max): 0.028" (0.70mm); LastUpdated: 8/02/2024 9:49:31 PM; Lifecycle Status: Active; Minimum Order: 1; Number of Terminations: 2; Operating Temperature: -55°C ~ 155°C; Package / Case: 1210 (3225 Metric); Packaging: TapeAndReel; Part Status: Active; Price: 0.07; Ratings: AEC-Q200; Resistance: 10 kOhms; Series: ERJ-P14; Size / Dimension: 0.126" L x 0.098" W (3.20mm x 2.50mm); Supplier 1: DigiKey; Supplier Part Number 1: P16083CT-ND; Supplier Device Package: 1210; Tolerance: ±0.5%; Value: 10 kOhms
R3 = ERJ-14NF1271U: RES SMD 1.27K OHM 1% 1/2W 1210; Manufacturer: Panasonic Electronic Components; Power (Watts): 0.5W, 1/2W; Temperature Coefficient: ±100ppm/°C; Part Number: ERJ-14NF1271U; ComponentLink1Description: Datasheet; ComponentLink1URL: https://industrial.panasonic.com/cdbs/www-data/pdf/RDA0000/AOA0000C304.pdf; ComponentLink2Description: DigiKey Link; ComponentLink2URL: https://www.digikey.com/en/products/detail/panasonic-electronic-components/ERJ-14NF1271U/383860; Composition: Thick Film; Device Package: 1210 (3225 Metric); Features: Automotive AEC-Q200; Height - Seated (Max): 0.028" (0.70mm); LastUpdated: 8/02/2024 9:49:38 PM; Lifecycle Status: Active; Minimum Order: 1; Number of Terminations: 2; Operating Temperature: -55°C ~ 155°C; Package / Case: 1210 (3225 Metric); Packaging: TapeAndReel; Part Status: Active; Price: 0.03; Ratings: AEC-Q200; Resistance: 1.27 kOhms; Series: ERJ-14N; Size / Dimension: 0.126" L x 0.098" W (3.20mm x 2.50mm); Supplier 1: DigiKey; Supplier Part Number 1: P1.27KAACT-ND; Supplier Device Package: 1210; Tolerance: ±1%; Value: 1.27 kOhms
R4 = RC1210JR-072KL: RES 2K OHM 5% 1/2W 1210; Manufacturer: Yageo; Power (Watts): 0.5W, 1/2W; Temperature Coefficient: ±100ppm/°C; Part Number: RC1210JR-072KL; ComponentLink1Description: Datasheet; ComponentLink1URL: https://www.yageo.com/upload/media/product/productsearch/datasheet/rchip/PYu-RC_Group_51_RoHS_L_11.pdf; ComponentLink2Description: DigiKey Link; ComponentLink2URL: https://www.digikey.com/en/products/detail/yageo/RC1210JR-072KL/5919910; Composition: Thick Film; Device Package: 1210 (3225 Metric); Features: Moisture Resistant; Height - Seated (Max): 0.024" (0.60mm); LastUpdated: 8/02/2024 9:49:20 PM; Lifecycle Status: Active; Minimum Order: 1; Number of Terminations: 2; Operating Temperature: -55°C ~ 155°C; Package / Case: 1210 (3225 Metric); Packaging: TapeAndReel; Part Status: Active; Price: 0.01; Resistance: 2 kOhms; Series: RC_L; Size / Dimension: 0.122" L x 0.102" W (3.10mm x 2.60mm); Supplier 1: DigiKey; Supplier Part Number 1: 13-RC1210JR-072KLCT-ND; Supplier Device Package: 1210; Tolerance: ±5%; Value: 2 kOhms
R5 R10 R12 = RK73H3ATTE1000F: RES 100 OHM 1% 1W 2512; manufacturer: KOA Speer Electronics, Inc.; Temperature Coefficient: ±100ppm/°C; Part Number: RK73H3ATTE1000F; componentlink1description: Datasheet; componentlink1url: http://www.koaspeer.com/catimages/Products/RK73H/RK73H.pdf; componentlink2description: DigiKey Link; componentlink2url: http://digikey.com/product-detail/en/koa-speer-electronics-inc/RK73H3ATTE1000F/2019-RK73H3ATTE1000FCT-ND/10425070; Composition: Thick Film; Device Package: 2512 (6432 Metric); Features: Automotive AEC-Q200, Moisture Resistant; Height - Seated (Max): 0.028" (0.70mm); lastupdated: 2/09/2020 1:26:50 AM; Lifecycle Status: Active; Minimum Order: 1; Number of Terminations: 2; Operating Temperature: -55°C ~ 155°C; Package / Case: 2512 (6432 Metric); packaging: TapeAndReel; Part Status: Active; Power (Watts): 1W; price: 0.05; Ratings: AEC-Q200; Resistance: 100 Ohms; series: RK73H; Size / Dimension: 0.248" L x 0.122" W (6.30mm x 3.10mm); Supplier 1: DigiKey; Supplier Part Number 1: 2019-RK73H3ATTE1000FCT-ND; Supplier Device Package: 2512; Tolerance: ±1%; value: 100 Ohms
R8 = RK73H3ATTE28R0F: as R36 on sheet PIC; Part Number: RK73H3ATTE28R0F; componentlink1description: Datasheet; componentlink1url: http://www.koaspeer.com/catimages/Products/RK73H/RK73H.pdf; componentlink2description: DigiKey Link; componentlink2url: http://digikey.com/product-detail/en/koa-speer-electronics-inc/RK73H3ATTE28R0F/2019-RK73H3ATTE28R0FCT-ND/10425047; Composition: Thick Film; Device Package: 2512 (6432 Metric); Features: Automotive AEC-Q200, Moisture Resistant; Height - Seated (Max): 0.028" (0.70mm); lastupdated: 11/04/2023 8:12:36 PM; Lifecycle Status: Active; Minimum Order: 1; Number of Terminations: 2; Operating Temperature: -55°C ~ 155°C; Package / Case: 2512 (6432 Metric); packaging: TapeAndReel; Part Status: Active; Power (Watts): 1W; price: 0.05; Ratings: AEC-Q200; Resistance: 28 Ohms; series: RK73H; Size / Dimension: 0.248" L x 0.122" W (6.30mm x 3.10mm); Supplier 1: DigiKey; Supplier Part Number 1: 2019-RK73H3ATTE28R0FCT-ND; Supplier Device Package: 2512; Tolerance: ±1%; value: 28 Ohms
R9 R11 R13 = CRCW2512215KFKEG: RES SMD 215K OHM 1% 1W 2512; manufacturer: Vishay Dale; Temperature Coefficient: ±100ppm/°C; Part Number: CRCW2512215KFKEG; componentlink1description: Datasheet; componentlink1url: http://www.vishay.com/docs/20035/dcrcwe3.pdf; componentlink2description: DigiKey Link; componentlink2url: http://digikey.com/product-detail/en/vishay-dale/CRCW2512215KFKEG/541-215KAFCT-ND/1178868; Composition: Thick Film; Device Package: 2512 (6432 Metric); Features: Automotive AEC-Q200; Height - Seated (Max): 0.028" (0.70mm); lastupdated: 16/04/2023 8:18:28 PM; Lifecycle Status: Active; Minimum Order: 1; Number of Terminations: 2; Operating Temperature: -55°C ~ 155°C; Package / Case: 2512 (6432 Metric); packaging: TapeAndReel; Part Status: Active; Power (Watts): 1W; price: 0.04; Ratings: AEC-Q200; Resistance: 215 kOhms; series: CRCW; Size / Dimension: 0.248" L x 0.124" W (6.30mm x 3.15mm); Supplier 1: DigiKey; Supplier Part Number 1: 541-215KAFCT-ND; Supplier Device Package: 2512; Tolerance: ±1%; value: 215 kOhms
R14 = CRGCQ2512F82R: RES 82 OHM 1% 1W 2512; manufacturer: TE Connectivity Passive Product; Temperature Coefficient: ±200ppm/°C; Part Number: CRGCQ2512F82R; componentlink1description: Datasheet; componentlink1url: https://www.te.com/commerce/DocumentDelivery/DDEController?Action=srchrtrv&DocNm=1773204-3&DocType=DS&DocLang=English; componentlink2description: DigiKey Link; componentlink2url: https://www.digikey.com/en/products/detail/te-connectivity-passive-product/CRGCQ2512F82R/8576582; Composition: Thick Film; Device Package: 2512 (6432 Metric); Features: Automotive AEC-Q200, Moisture Resistant; Height - Seated (Max): 0.026" (0.65mm); lastupdated: 17/02/2022 6:29:19 PM; Lifecycle Status: Active; Minimum Order: 1; Number of Terminations: 2; Operating Temperature: -55°C ~ 155°C; Package / Case: 2512 (6432 Metric); packaging: TapeAndReel; Part Status: Active; Power (Watts): 1W; price: 0.06; Ratings: AEC-Q200; Resistance: 82 Ohms; series: CRGCQ; Size / Dimension: 0.250" L x 0.126" W (6.35mm x 3.20mm); Supplier 1: DigiKey; Supplier Part Number 1: A129980CT-ND; Supplier Device Package: 2512; Tolerance: ±1%; value: 82 Ohms
R15 = CRCW2512130RFKEG: RES SMD 130 OHM 1% 1W 2512; manufacturer: Vishay Dale; Temperature Coefficient: ±100ppm/°C; Part Number: CRCW2512130RFKEG; componentlink1description: Datasheet; componentlink1url: http://www.vishay.com/docs/20035/dcrcwe3.pdf; componentlink2description: DigiKey Link; componentlink2url: http://digikey.com/product-detail/en/vishay-dale/CRCW2512130RFKEG/541-130AFCT-ND/3232072; Composition: Thick Film; Device Package: 2512 (6432 Metric); Features: Automotive AEC-Q200; Height - Seated (Max): 0.028" (0.70mm); lastupdated: 2/09/2020 1:26:55 AM; Lifecycle Status: Active; Minimum Order: 1; Number of Terminations: 2; Operating Temperature: -55°C ~ 155°C; Package / Case: 2512 (6432 Metric); packaging: TapeAndReel; Part Status: Active; Power (Watts): 1W; price: 0.04; Ratings: AEC-Q200; Resistance: 130 Ohms; series: CRCW; Size / Dimension: 0.248" L x 0.124" W (6.30mm x 3.15mm); Supplier 1: DigiKey; Supplier Part Number 1: 541-130AFCT-ND; Supplier Device Package: 2512; Tolerance: ±1%; value: 130 Ohms
T1 = 750310042: WE-PoE++ Power over Ethernet Plus Plus Transformer, THT, EFD20, Ui = 30-57V, Uo1 = 12V/5A, Uo2 = -12V/1.6A; Manufacturer: Wurth Elektronik; Auxiliary Voltage: 12V; Inductance: 154uH; Input Voltage: 30-57VDC; Insulation Test Voltage: 1500V; Leakage Inductance: 2uH; Output Current 1: 5A; Output Current 2: 1.6A; Output Voltage 2: -12V; Switching Frequency: 250-400kHz; Turns Ratio: 2:1:1:1; Manufacturer Part Number: 750310042; Category: Transformers For DC-DC Converter; Match Code: WE-PoE++; ComponentLink1Description: Website Link; ComponentLink1URL: https://www.we-online.com/redexpert/article/750310042?ad; ComponentLink2Description: Datasheet Link; ComponentLink2URL: https://www.we-online.com/redexpert/spec/750310042?ad; Mount: Through Hole; Operating Temperature Max: 125°C; Operating Temperature Min: -40°C; Packaging: Tape and Reel; Case/Size Code: EFD20; Length: 21.08mm; Width: 21.08mm; Height: 10.8mm; Output Voltage 1: 12V
TP1-TP12 = Test_point_1

## Sheet Oscillator.SchDoc
size A4; SheetNumber: 3; SheetTotal: 5
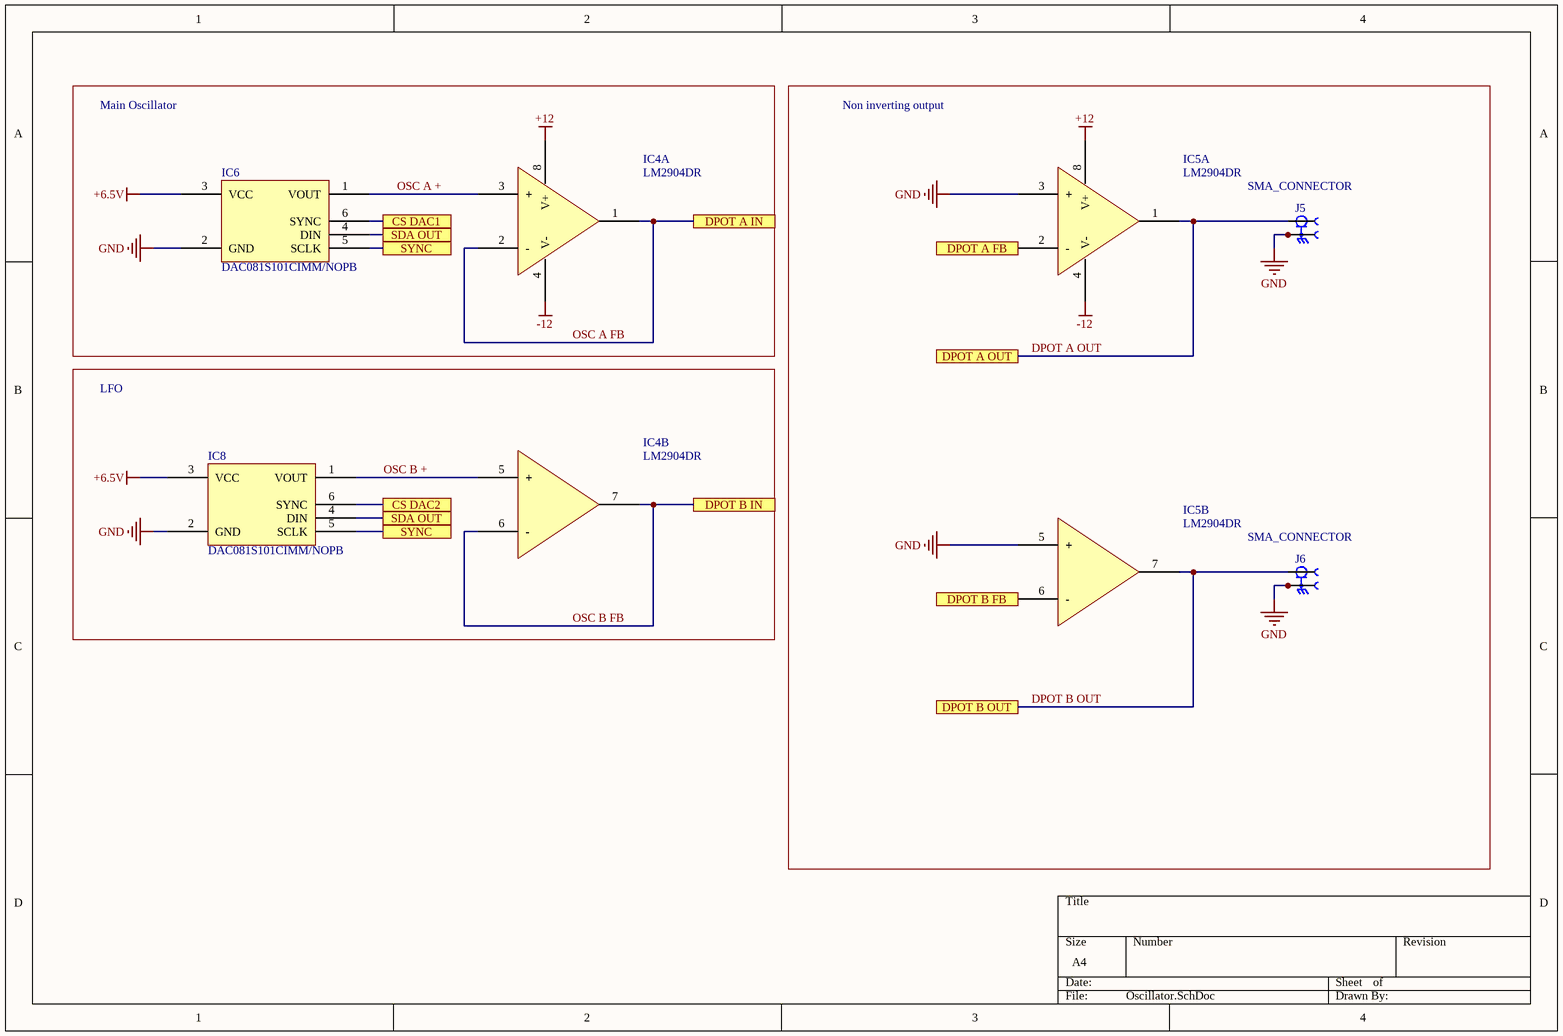
[diagram p2: Oscillator.SchDoc]

### Parts
IC4  LM2904DR  [TI SOIC-8 D]  (parts A,B of 2)
IC5  LM2904DR  [TI SOIC-8 D]  (parts A,B of 2)
IC6  DAC081S101CIMM/NOPB  [TI VSSOP-8 DGK]
IC8  DAC081S101CIMM/NOPB  [TI VSSOP-8 DGK]
J5  SMA_CONNECTOR  [LPRS_SMA_CONNECTOR]
J6  SMA_CONNECTOR  [LPRS_SMA_CONNECTOR]

### Blocks framed on the sheet
Main Oscillator: IC4 IC6
Non inverting output: IC5 J5 J6
LFO: IC4 IC8

### Ports
CS DAC1, CS DAC2, DPOT A FB, DPOT A IN, DPOT A OUT, DPOT B FB, DPOT B IN, DPOT B OUT, SDA OUT, SYNC

### Nets
+6.5V: IC6.3(VCC) IC8.3(VCC)
+12: IC4.8(V+) IC5.8(V+)
-12: IC4.4(V-) IC5.4(V-)
GND: IC5.3(+) IC5.5(+) IC6.2(GND) IC8.2(GND) J5.G1 J5.G2 J5.G3 J5.G4 J6.G1 J6.G2 J6.G3 J6.G4
DPOT A FB: IC5.2(-) ; port DPOT A FB
DPOT A OUT: IC5.1(OUTA) J5.1 ; port DPOT A OUT
DPOT B FB: IC5.6(-) ; port DPOT B FB
DPOT B OUT: IC5.7(OUTB) J6.1 ; port DPOT B OUT
OSC A +: IC4.3(+) IC6.1(VOUT)
OSC A FB: IC4.1(OUTA) IC4.2(-) ; port DPOT A IN  [project net DPOT A IN]
OSC B +: IC4.5(+) IC8.1(VOUT)
OSC B FB: IC4.6(-) IC4.7(OUTB) ; port DPOT B IN  [project net DPOT B IN]
SDA OUT: IC6.4(DIN) IC8.4(DIN) ; port SDA OUT
SYNC: IC6.5(SCLK) IC8.5(SCLK) ; port SYNC
NetIC6_6: IC6.6(SYNC) ; port CS DAC1
NetIC8_6: IC8.6(SYNC) ; port CS DAC2

### Library data of the parts
IC4 IC5 = LM2904DR: IC OPAMP GP 2 CIRCUIT 8SOIC; Manufacturer: Texas Instruments; Amplifier Type: General Purpose; Current - Input Bias: 20nA; Current - Output / Channel: 30mA; Current - Supply: 1mA; Gain Bandwidth Product: 700kHz; Number of Circuits: 2; Slew Rate: 0.3V/µs; Voltage - Input Offset: 3mV; Voltage - Supply, Single/Dual (±): 3V ~ 26V, ±1.5V ~ 13V; Part Number: LM2904DR; ComponentLink1Description: Datasheet; ComponentLink1URL: http://www.ti.com/general/docs/suppproductinfo.tsp?distId=10&gotoUrl=http%3A%2F%2Fwww.ti.com%2Flit%2Fgpn%2Flm258a; ComponentLink2Description: DigiKey Link; ComponentLink2URL: http://digikey.com/product-detail/en/texas-instruments/LM2904DR/296-14596-1-ND/555533; Device Package: 8-SOIC (0.154", 3.90mm Width); LastUpdated: 9/01/2020 2:06:28 AM; Lifecycle Status: Active; Minimum Order: 1; Mounting Type: Surface Mount; Operating Temperature: -40°C ~ 125°C; Package / Case: 8-SOIC (0.154", 3.90mm Width); Packaging: ReReel; PartId: 4; Part Status: Active; Price: 0.00; Series: -; Supplier 1: DigiKey; Supplier Part Number 1: 296-14596-1-ND; Supplier Device Package: 8-SOIC
IC6 IC8 = DAC081S101CIMM/NOPB: IC DAC 8BIT V-OUT 8VSSOP; Part Number: DAC081S101CIMM/NOPB
J5 J6 = SMA_CONNECTOR: Straight SMA Connector; MP: altium_native_batch; Value: *; Package: None; Availability: Unavailable; Price: None